# EasyEDA schematic wiring layout.json
TITLE: Sheet_1; REV: 1.0; Date: 2025-11-14; Sheet: 1/1; Company: Your Company
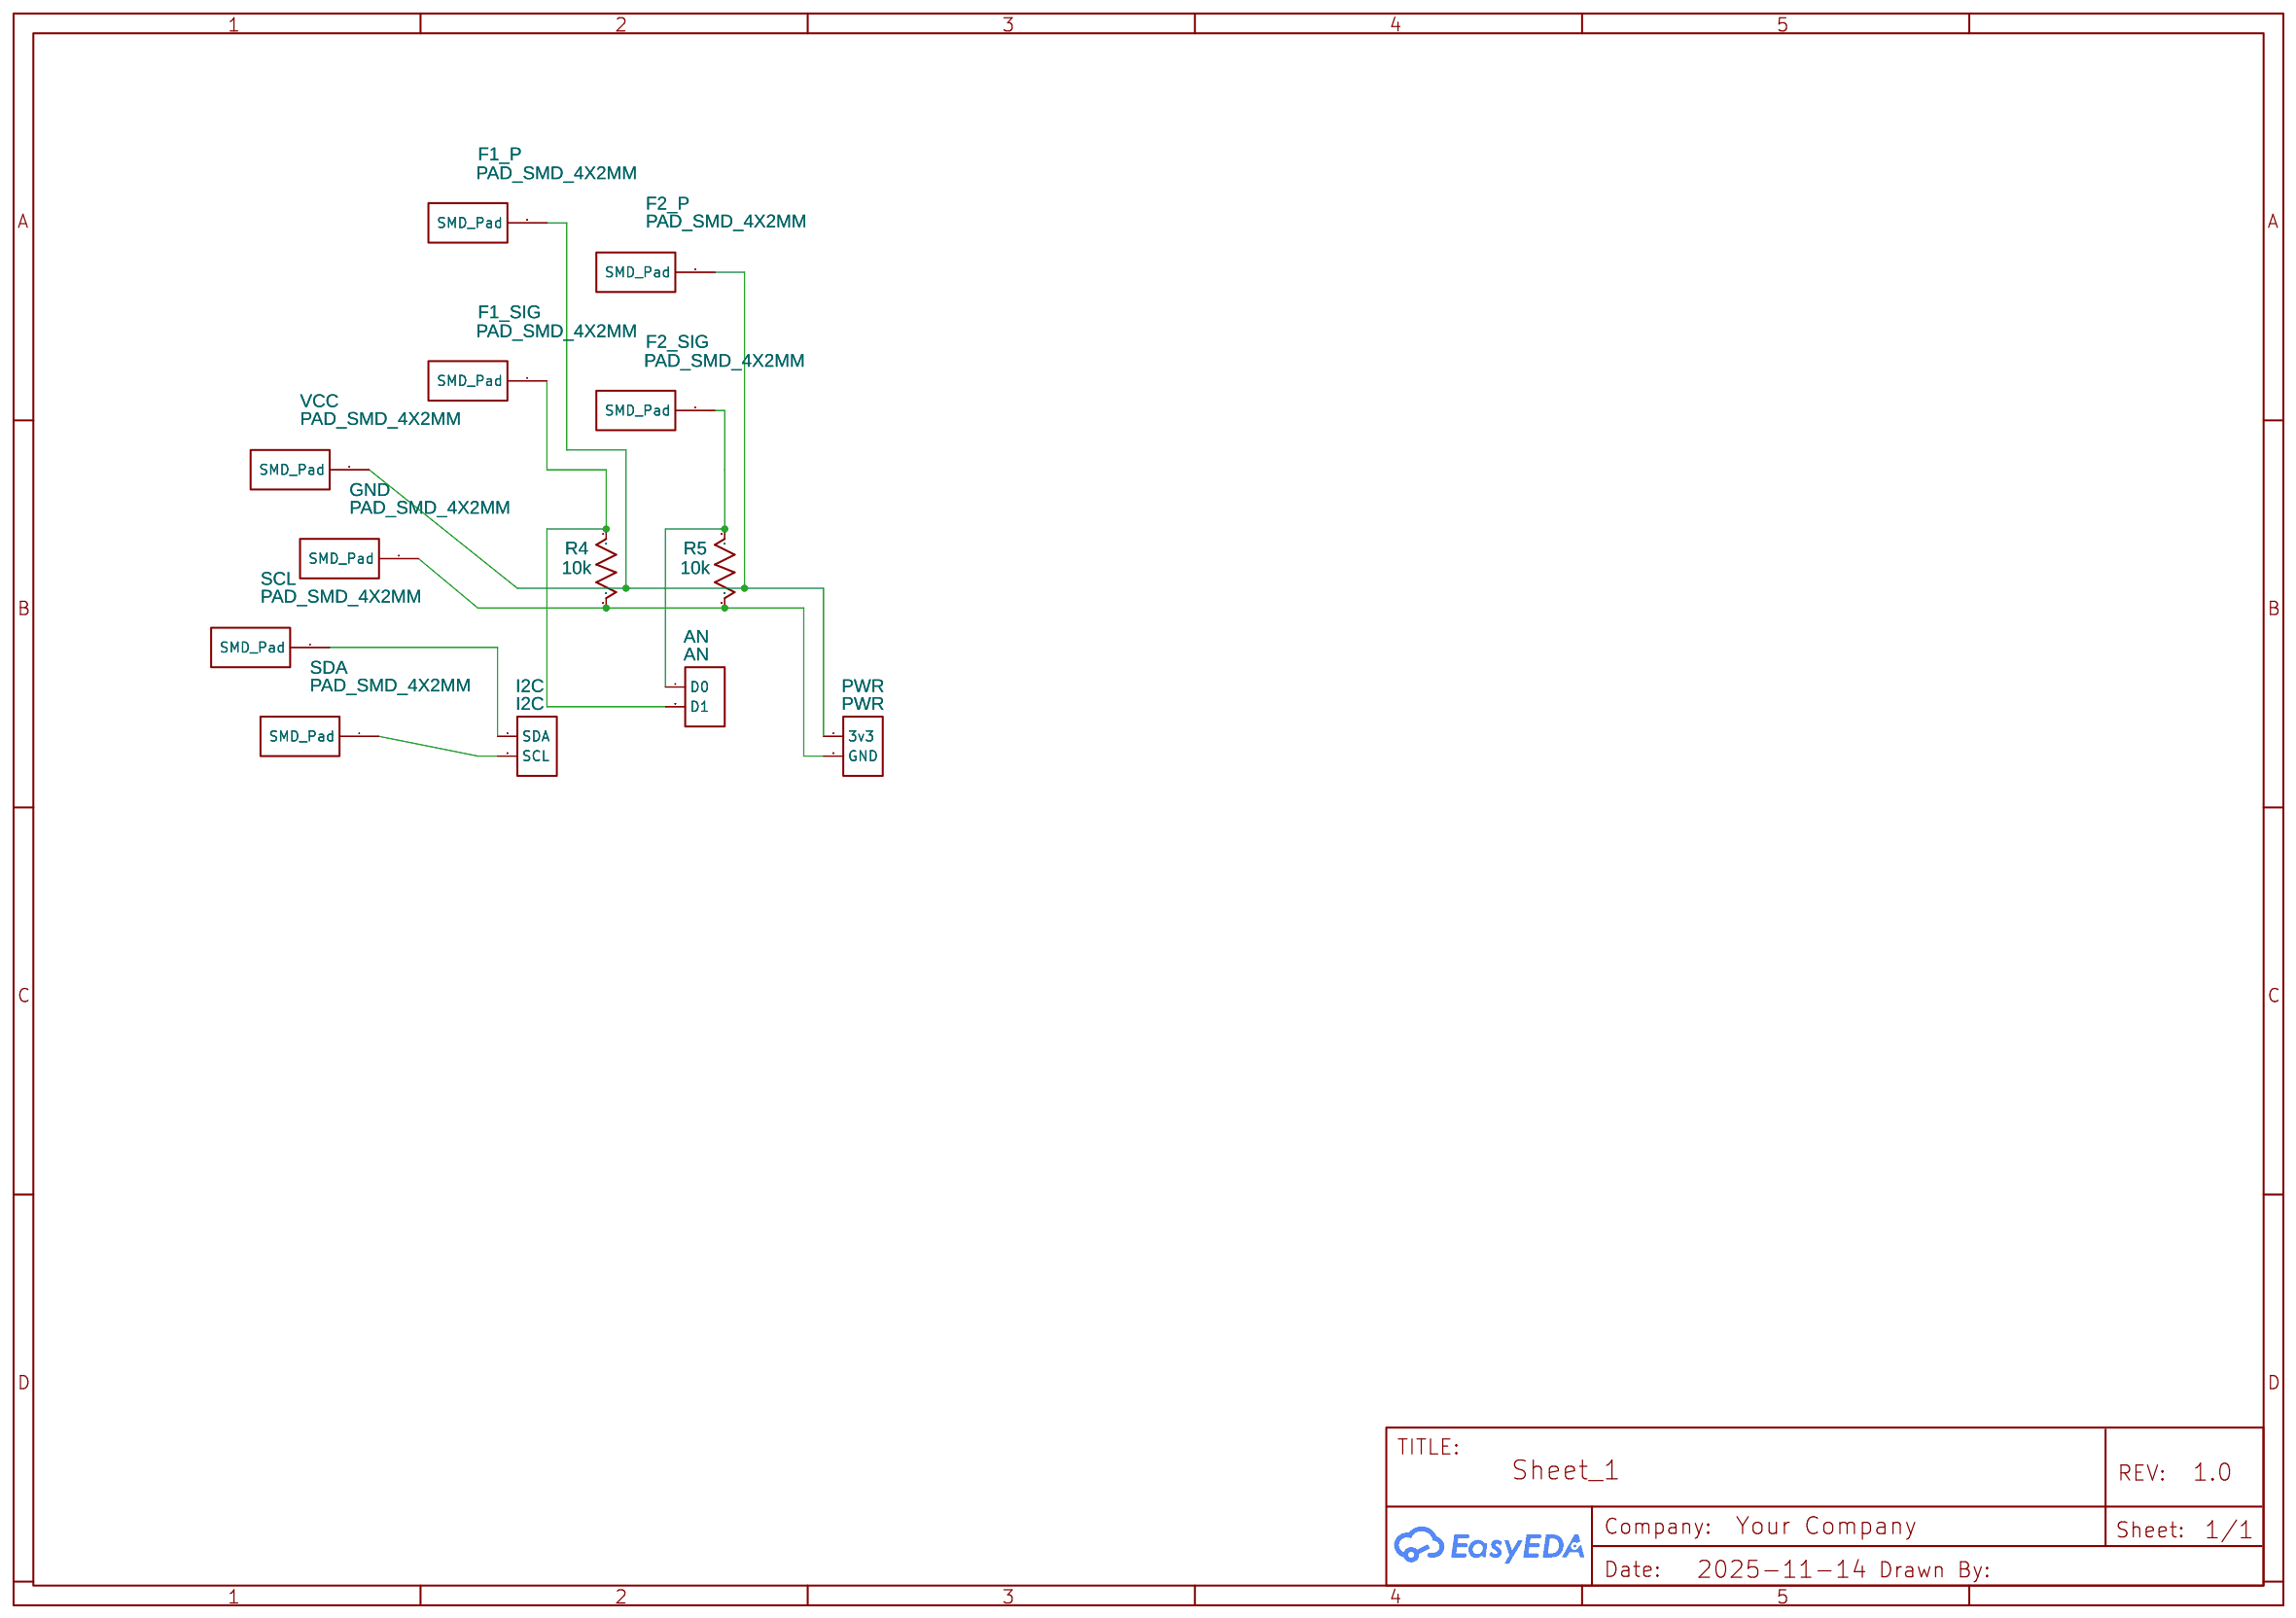
[diagram p0: schematic sheet]

## Parts
AN  AN  [HDR-M-2.54_1X2]
F1_P  PAD_SMD_4X2MM  [PADPAD]
F1_SIG  PAD_SMD_4X2MM  [PADPAD]
F2_P  PAD_SMD_4X2MM  [PADPAD]
F2_SIG  PAD_SMD_4X2MM  [PADPAD]
GND  PAD_SMD_4X2MM  [PADPAD]
I2C  I2C  [HDR-M-2.54_1X2]
PWR  PWR  [HDR-M-2.54_1X2]
R4  10k  [R1206]
R5  10k  [R1206]
SCL  PAD_SMD_4X2MM  [PADPAD]
SDA  PAD_SMD_4X2MM  [PADPAD]
VCC  PAD_SMD_4X2MM  [PADPAD]

## Library data of the parts
AN I2C PWR = HDR-M-2.54_1x2: Supplier Part: C124375; Supplier: LCSC; Contributor: LCEDA_Lib
F1_P F1_SIG F2_P F2_SIG GND SCL SDA VCC = PAD_SMD_4X2MM: Contributor: Ivan Pavelic
R4 R5 = R_1206_US: Contributor: LCEDA_Lib

## Nets
Net-(AN-1): AN.1(D0) F2_SIG.1(SMD Pad) R5.1
Net-(AN-2): AN.2(D1) F1_SIG.1(SMD Pad) R4.1
Net-(F1_P-1): F1_P.1(SMD Pad) F2_P.1(SMD Pad) PWR.1(3v3) VCC.1(SMD Pad)
Net-(GND-1): GND.1(SMD Pad) PWR.2(GND) R4.2 R5.2
Net-(I2C-1): I2C.1(SDA) SCL.1(SMD Pad)
Net-(I2C-2): I2C.2(SCL) SDA.1(SMD Pad)
